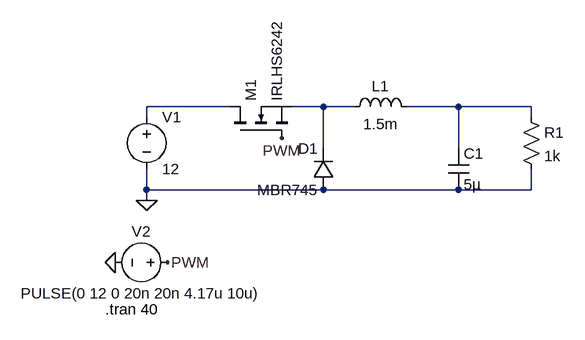
[diagram p0: schematic BUCK.asc]
BUCK.asc, the LTspice schematic file:
Version 4.1
SHEET 1 880 680
WIRE 128 96 0 96
WIRE 272 96 224 96
WIRE 320 96 272 96
WIRE 480 96 400 96
WIRE 592 96 480 96
WIRE 0 112 0 96
WIRE 592 112 592 96
WIRE 272 160 272 96
WIRE 480 160 480 96
WIRE 0 224 0 192
WIRE 272 224 0 224
WIRE 480 224 272 224
WIRE 592 224 592 192
WIRE 592 224 480 224
WIRE 0 240 0 224
FLAG -48 336 0
FLAG 0 240 0
FLAG 32 336 PWM
FLAG 208 144 PWM
SYMBOL voltage 0 96 R0
WINDOW 123 0 0 Left 0
WINDOW 39 0 0 Left 0
SYMATTR InstName V1
SYMATTR Value 12
SYMBOL ind 304 112 R270
WINDOW 0 32 56 VTop 2
WINDOW 3 5 56 VBottom 2
SYMATTR InstName L1
SYMATTR Value 1.5m
SYMBOL cap 464 160 R0
SYMATTR InstName C1
SYMATTR Value 5µ
SYMATTR SpiceLine Rser=20m
SYMBOL voltage 48 336 R90
WINDOW 0 -32 56 VBottom 2
WINDOW 3 32 56 VTop 2
WINDOW 123 0 0 Left 0
WINDOW 39 0 0 Left 0
SYMATTR InstName V2
SYMATTR Value PULSE(0 12 0 20n 20n 4.17u 10u)
SYMBOL diode 288 224 R180
WINDOW 0 24 64 Left 2
WINDOW 3 24 0 Left 2
SYMATTR InstName D1
SYMATTR Value MBR745
SYMBOL nmos 128 144 R270
SYMATTR InstName M1
SYMATTR Value IRLHS6242
SYMBOL res 576 96 R0
SYMATTR InstName R1
SYMATTR Value 1k
TEXT -64 408 Left 2 !.tran 40

The netlist it stands for:
* BUCK.asc
V1 N001 0 12
L1 N002 N003 1.5m
C1 N003 0 5µ Rser=20m
V2 PWM 0 PULSE(0 12 0 20n 20n 4.17u 10u)
D1 0 N002 MBR745
M1 N001 PWM N002 N002 IRLHS6242
R1 N003 0 1k
.model D D
.lib standard.dio
.model NMOS NMOS
.model PMOS PMOS
.lib standard.mos
.tran 40
.backanno
.end